# EAGLE design Wilssen_core_v0.214a (EAGLE 6.3)
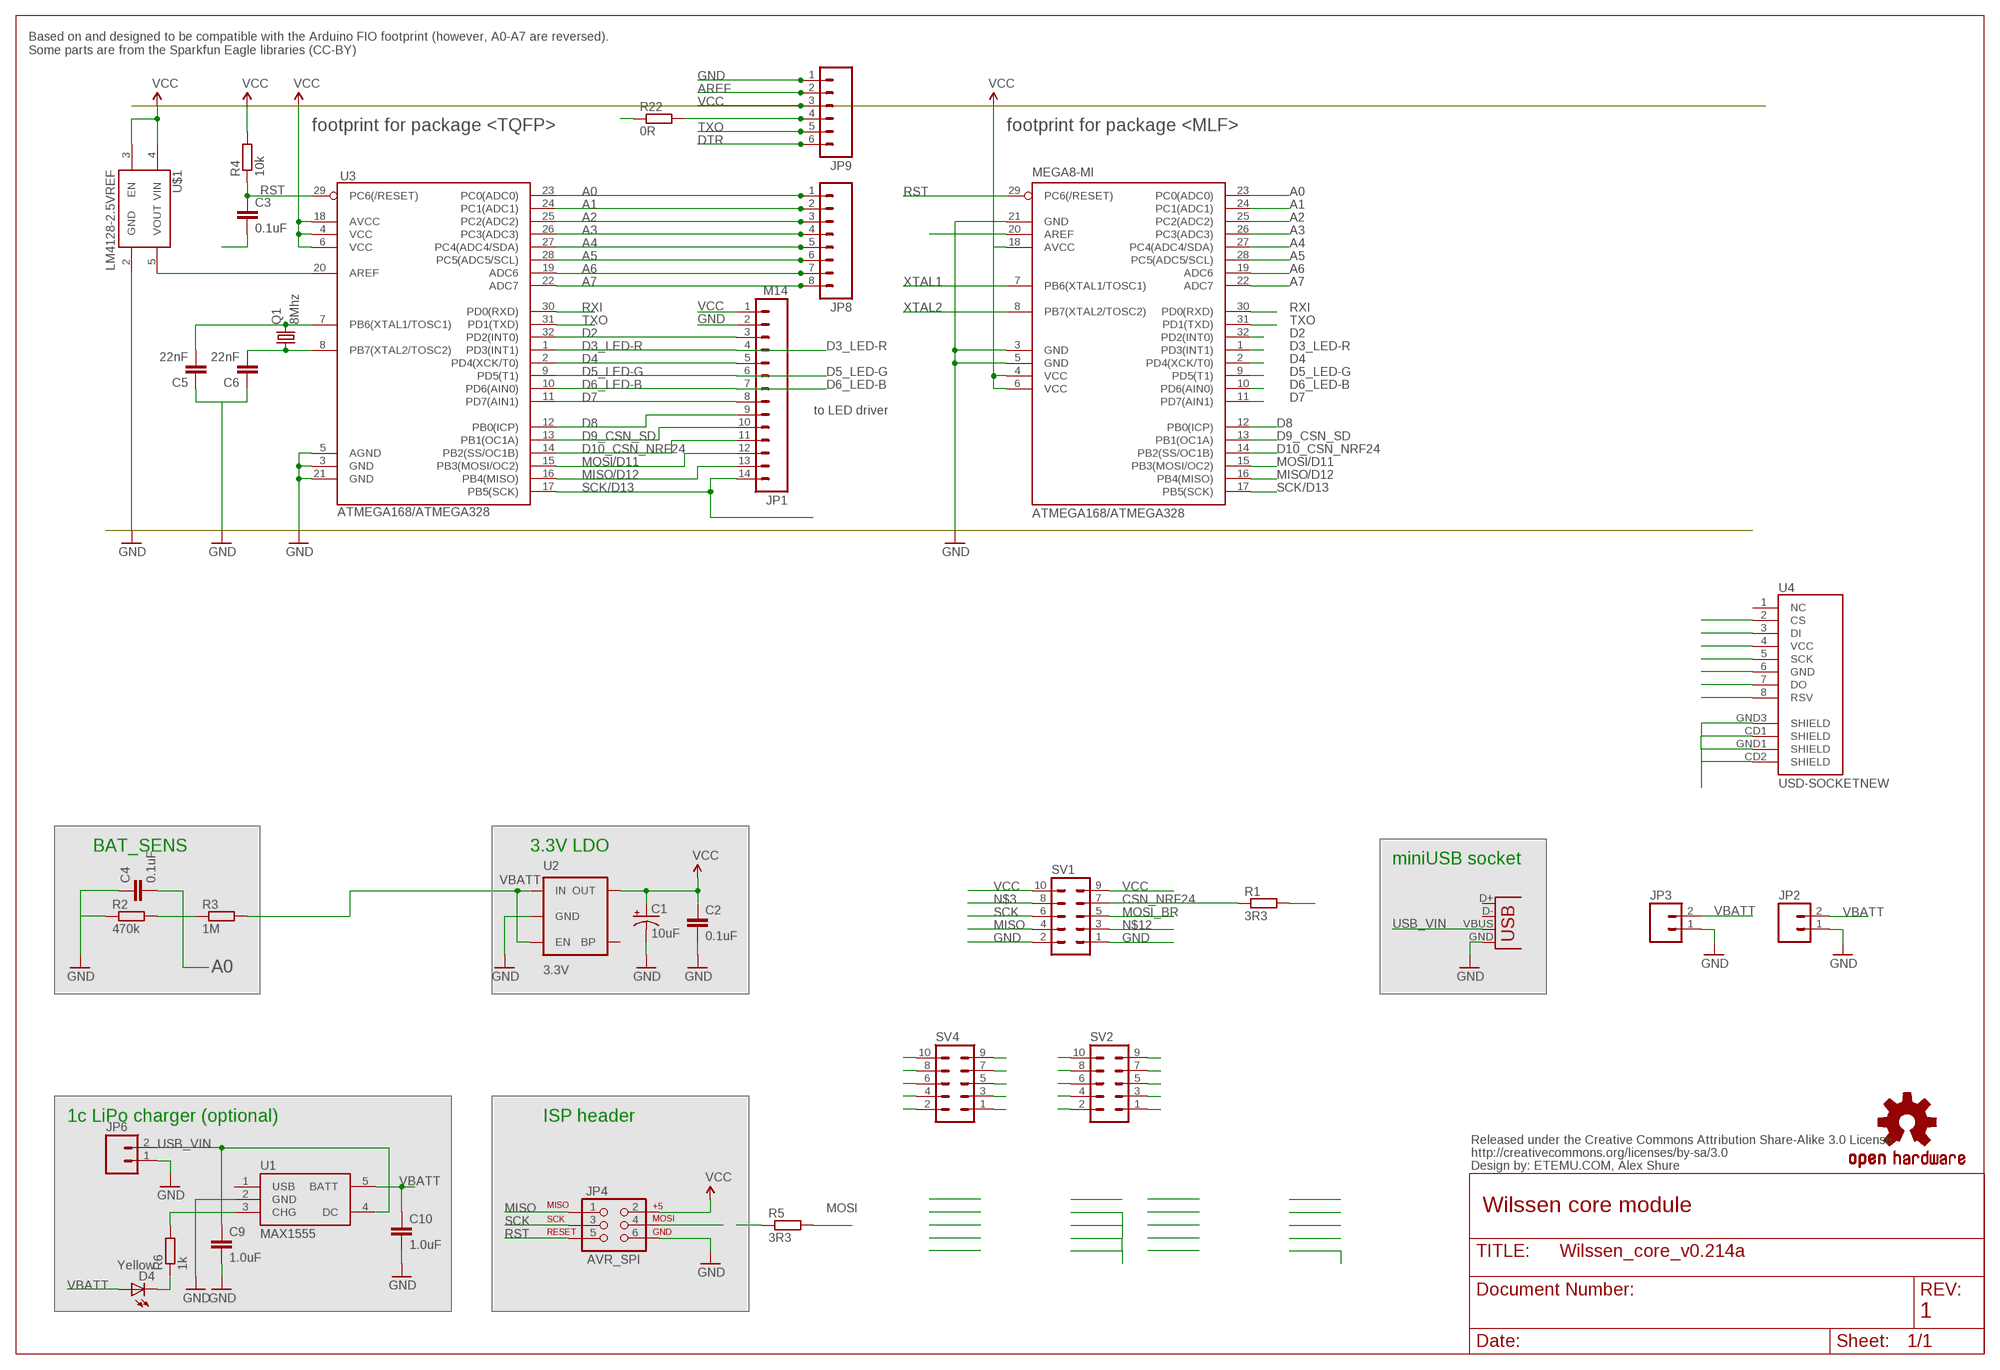
[diagram p0: schematic, sheet 1, part 1 of 2]
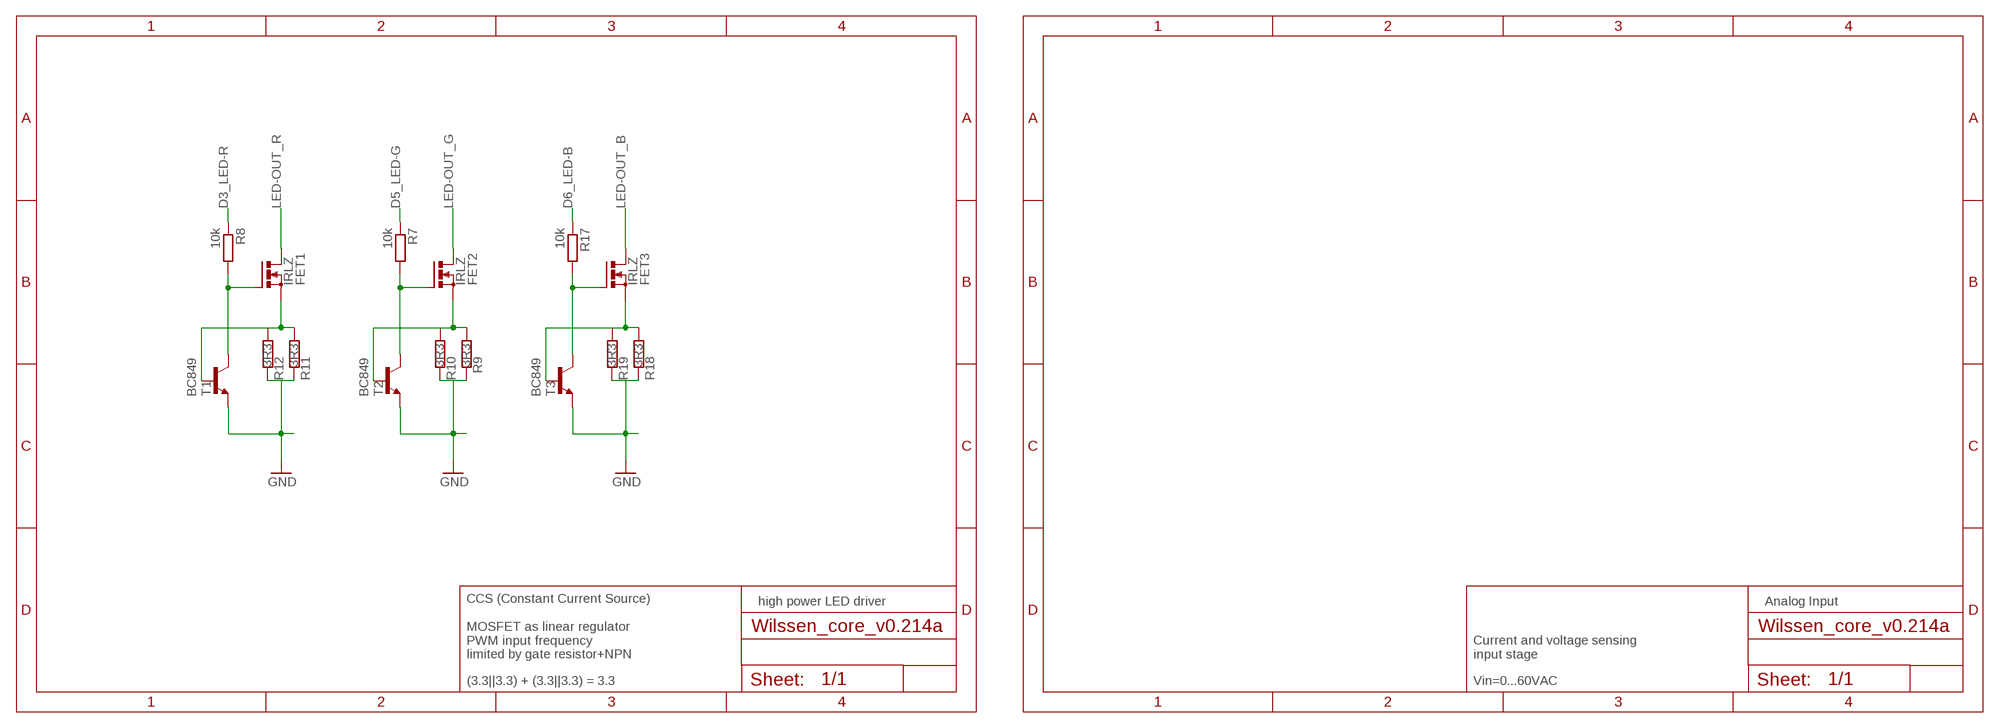
[diagram p1: schematic, sheet 1, part 2 of 2]

## Parts
ATMEGA168/ATMEGA328  MEGA8-MI  [MLF32]
C1  10uF  CAP_POL1206  [EIA3216]
C2  0.1uF  CAP0805  [0805]
C3  0.1uF  CAP0805  [0805]
C4  0.1uF  CAP0805  [0805]
C5  22nF  CAP0805  [0805]
C6  22nF  CAP0805  [0805]
C9  1.0uF  CAP0805  [0805]
C10  1.0uF  CAP0805  [0805]
CC_TEXT1  CREATIVE_COMMONS  [CREATIVE_COMMONS]
D4  Yellow  LED0603  [LED-0603]
FET1  IRLZ  PMOSFET_NTO220BV  [TO220BV]
FET2  IRLZ  PMOSFET_NTO220BV  [TO220BV]
FET3  IRLZ  PMOSFET_NTO220BV  [TO220BV]
JP1  M14  [1X14]
JP2  M02PTH  [1X02]
JP3  M02-JST-2MM-SMT  [S2B-PH]
JP4  AVR_SPI  AVR_SPI_PRG_6PTH  [2X3]
JP6  M02PTH  [1X02]
JP8  M081X08  [1X08]
JP9  M06SIP  [1X06]
LOGO1  OSHW-LOGOS  [OSHW-LOGO-S]
Q1  8Mhz  CRYSTALSM49  [SM49]
R1  3R3  R-EU_R1206  [R1206]
R2  470k  R-EU_R0805  [R0805]
R3  1M  R-EU_R0805  [R0805]
R4  10k  R-EU_R0805  [R0805]
R5  3R3  R-EU_R1206  [R1206]
R6  1k  R-EU_R0805  [R0805]
R7  10k  R-EU_R0805  [R0805]
R8  10k  R-EU_R0805  [R0805]
R9  3R3  R-EU_R1206  [R1206]
R10  3R3  R-EU_R1206  [R1206]
R11  3R3  R-EU_R1206  [R1206]
R12  3R3  R-EU_R1206  [R1206]
R17  10k  R-EU_R0805  [R0805]
R18  3R3  R-EU_R1206  [R1206]
R19  3R3  R-EU_R1206  [R1206]
R22  0R  R-EU_R1206  [R1206]
SV1  MA05-2  [MA05-2]
SV2  MA05-2  [MA05-2]
SV4  MA05-2  [MA05-2]
T1  BC849  [SOT23]
T2  BC849  [SOT23]
T3  BC849  [SOT23]
U1  MAX1555  [SOT23-5]
U2  3.3V  V_REG_LDOSMD  [SOT23-5]
U3  ATMEGA168/ATMEGA328  ATMEGA168  [TQFP32-08]
U4  USD-SOCKETNEW  [MICRO-SD-SOCKET-PP]
U$1  LM4128-2.5VREF  [SOT23-5]
X1  USBSMD  [USB-MINIB]

## Nets
A0: ATMEGA168/ATMEGA328.23(PC0(ADC0)) C4.2 JP8.1 R2.2 R3.1 U3.23(PC0(ADC0))
A1: ATMEGA168/ATMEGA328.24(PC1(ADC1)) JP8.2 U3.24(PC1(ADC1))
A2: ATMEGA168/ATMEGA328.25(PC2(ADC2)) JP8.3 U3.25(PC2(ADC2))
A3: ATMEGA168/ATMEGA328.26(PC3(ADC3)) JP8.4 U3.26(PC3(ADC3))
A4: ATMEGA168/ATMEGA328.27(PC4(ADC4/SDA)) JP8.5 U3.27(PC4(ADC4/SDA))
A5: ATMEGA168/ATMEGA328.28(PC5(ADC5/SCL)) JP8.6 U3.28(PC5(ADC5/SCL))
A6: ATMEGA168/ATMEGA328.19(ADC6) JP8.7 U3.19(ADC6)
A7: ATMEGA168/ATMEGA328.22(ADC7) JP8.8 U3.22(ADC7)
AREF: ATMEGA168/ATMEGA328.20(AREF) JP9.2 U3.20(AREF) U$1.5(VOUT)
CSN: SV2.8 SV4.8
CSN_NRF24: R1.1 SV1.7
D2: ATMEGA168/ATMEGA328.32(PD2(INT0)) JP1.3 U3.32(PD2(INT0))
D3_LED-R: ATMEGA168/ATMEGA328.1(PD3(INT1)) JP1.4 R8.1 U3.1(PD3(INT1))
D4: ATMEGA168/ATMEGA328.2(PD4(XCK/T0)) JP1.5 U3.2(PD4(XCK/T0))
D5_LED-G: ATMEGA168/ATMEGA328.9(PD5(T1)) JP1.6 R7.1 U3.9(PD5(T1))
D6_LED-B: ATMEGA168/ATMEGA328.10(PD6(AIN0)) JP1.7 R17.1 U3.10(PD6(AIN0))
D7: ATMEGA168/ATMEGA328.11(PD7(AIN1)) JP1.8 U3.11(PD7(AIN1))
D8: ATMEGA168/ATMEGA328.12(PB0(ICP)) JP1.9 U3.12(PB0(ICP))
D9_CSN_SD: ATMEGA168/ATMEGA328.13(PB1(OC1A)) JP1.10 U3.13(PB1(OC1A)) U4.2(CS)
D10_CSN_NRF24: ATMEGA168/ATMEGA328.14(PB2(SS/OC1B)) JP1.11 R1.2 U3.14(PB2(SS/OC1B))
DTR: C3.2 JP9.6
GATE1: FET1.G R8.2 T1.3(C)
GATE2: FET2.G R7.2 T2.3(C)
GATE3: FET3.G R17.2 T3.3(C)
GND: ATMEGA168/ATMEGA328.3(GND) ATMEGA168/ATMEGA328.5(GND) ATMEGA168/ATMEGA328.21(GND) C1.C(-) C2.2 C4.1 C5.1 C6.1 C9.2 C10.2 JP1.2 JP2.1 JP3.1 JP4.6 JP6.1 JP9.1 R2.1 R9.2 R10.2 R11.2 R12.2 R18.2 R19.2 SV1.1 SV1.2 SV4.1 SV4.3 SV4.5 SV4.7 T1.2(E) T2.2(E) T3.2(E) U1.2(GND) U2.2(GND) U3.3(GND) U3.5(AGND) U3.21(GND) U4.6(GND) U4.CD1(SHIELD) U4.CD2(SHIELD) U4.GND1(SHIELD) U4.GND3(SHIELD) U$1.2(GND) X1.GND
LED-OUT_B: FET3.D
LED-OUT_G: FET2.D
LED-OUT_R: FET1.D
MISO: ATMEGA168/ATMEGA328.16(PB4(MISO)) JP1.13 JP4.1 SV1.4 SV2.2 SV4.2 U3.16(PB4(MISO))
MOSI: ATMEGA168/ATMEGA328.15(PB3(MOSI/OC2)) JP1.12 JP4.4 R5.2 SV2.10 SV4.10 U3.15(PB3(MOSI/OC2))
MOSI_BR: SV1.5
N$1: R5.1
N$3: SV1.8
N$5: U4.3(DI)
N$8: D4.C R6.1
N$11: R6.2 U1.3(CHG)
N$12: SV1.3
N$15: U4.7(DO)
N$16: U4.8(RSV)
RST: ATMEGA168/ATMEGA328.29(PC6(/RESET)) C3.1 JP4.5 R4.1 SV2.6 SV4.6 U3.29(PC6(/RESET))
RXI: ATMEGA168/ATMEGA328.30(PD0(RXD)) R22.1 U3.30(PD0(RXD))
RXI_CON: JP9.4 R22.2
SCK: ATMEGA168/ATMEGA328.17(PB5(SCK)) JP1.14 JP4.3 SV1.6 SV2.4 SV4.4 U3.17(PB5(SCK)) U4.5(SCK)
SRC1: FET1.S R11.1 R12.1 T1.1(B)
SRC2: FET2.S R9.1 R10.1 T2.1(B)
SRC3: FET3.S R18.1 R19.1 T3.1(B)
TXO: ATMEGA168/ATMEGA328.31(PD1(TXD)) JP9.5 U3.31(PD1(TXD))
USB_VIN: C9.1 JP6.2 U1.4(DC) X1.VBUS
VBATT: C10.1 D4.A JP2.2 JP3.2 R3.2 U1.5(BATT) U2.1(IN) U2.3(EN)
VCC [VCC]: ATMEGA168/ATMEGA328.4(VCC) ATMEGA168/ATMEGA328.6(VCC) ATMEGA168/ATMEGA328.18(AVCC) C1.A(+) C2.1 JP1.1 JP4.2 JP9.3 R4.2 SV1.9 SV1.10 SV4.9 U2.5(OUT) U3.4(VCC) U3.6(VCC) U3.18(AVCC) U4.4(VCC) U$1.3(EN) U$1.4(VIN)
XTAL1: ATMEGA168/ATMEGA328.7(PB6(XTAL1/TOSC1)) C5.2 Q1.2 U3.7(PB6(XTAL1/TOSC1))
XTAL2: ATMEGA168/ATMEGA328.8(PB7(XTAL2/TOSC2)) C6.2 Q1.1 U3.8(PB7(XTAL2/TOSC2))
Unconnected: SV2.1 SV2.3 SV2.5 SV2.7 SV2.9 U1.1(USB) U2.4(BP) U4.1(NC) X1.D+ X1.D-

## Notes on the sheet
- Based on and designed to be compatible with the Arduino FIO footprint (however, A0-A7 are reversed).
  Some parts are from the Sparkfun Eagle libraries (CC-BY)
- footprint for package <TQFP> | footprint for package <MLF>
- to LED driver
- /D11 | /D11
- /D12 | /D12
- /D13 | /D13
- BAT_SENS | 3.3V LDO
- miniUSB socket
- 1c LiPo charger (optional) | ISP header
- ETEMU.COM, Alex Shure
- Wilssen core module
- high power LED driver | Analog Input
- CCS (Constant Current Source)
  
  MOSFET as linear regulator
  PWM input frequency
  limited by gate resistor+NPN
- Current and voltage sensing
  input stage
- 1
- (3.3||3.3) + (3.3||3.3) = 3.3 | Vin=0...60VAC

## Library data of the parts
ATMEGA168/ATMEGA328 = atmel:MEGA8: MICROCONTROLLER 8 Kbytes FLASH, 1 kbytes SRAM, 512 bytes EEPROM, USART, 6-channel 10 bit ADC, 2-channel 8 bit ADC Pin compatible with Atmega48, ATMega88, ATMega168 Source: avr.lbr; MPN: ATMEGA88PA-MU; OC_FARNELL: 1715491; OC_NEWARK: 15R0272
C1 = SparkFun:CAP_POL: Capacitor Polarized These are standard SMD and PTH capacitors. Normally 10uF, 47uF, and 100uF in electrolytic and tantalum varieties. Always verify the external diameter of the through hole cap, it varies with capacity, voltage, and manufacturer. The EIA devices should be standard.
C2-C6 C9 C10 = SparkFun:CAP: Capacitor Standard 0603 ceramic capacitor, and 0.1" leaded capacitor.
CC_TEXT1 = SparkFun-Aesthetics:CREATIVE_COMMONS: Creative Commons License summary
D4 = SparkFun:LED: LEDs Standard schematic elements and footprints for 5mm, 3mm, 1206, and 0603 sized LEDs. 5mm - Spark Fun Electronics SKU : COM-00529 (and others)
FET1-FET3 = transistor-power:PMOSFET_N: Power MOSFET N-Channel
JP1 = SparkFun:M14: Header 14 Standard 14-pin 0.1" header. Use with straight break away headers (SKU : PRT-00116), right angle break away headers (PRT-00553), swiss pins (PRT-00743), machine pins (PRT-00117), and female headers (PRT-00115).
JP2 JP3 JP6 = SparkFun:M02: Header 2 Standard 2-pin 0.1" header. Use with straight break away headers (SKU : PRT-00116), right angle break away headers (PRT-00553), swiss pins (PRT-00743), machine pins (PRT-00117), and female headers (PRT-00115). Molex polarized connector foot print use with SKU : PRT-08233 with associated crimp pins and housings.
JP4 = SparkFun:AVR_SPI_PRG_6: AVR ISP 6 Pin This is the reduced ISP connector for AVR programming. Common on Arduino. This footprint will take up less PCB space and can be used with a 10-pin to 6-pin adapter such as SKU: BOB-08508
JP8 = SparkFun-Connectors:M08: Header 8 Standard 8-pin 0.1" header. Use with straight break away headers (SKU : PRT-00116), right angle break away headers (PRT-00553), swiss pins (PRT-00743), machine pins (PRT-00117), and female headers (PRT-00115).
JP9 = SparkFun-Connectors:M06: Header 6 Standard 6-pin 0.1" header. Use with straight break away headers (SKU : PRT-00116), right angle break away headers (PRT-00553), swiss pins (PRT-00743), machine pins (PRT-00117), and female headers (PRT-00115). Molex polarized connector foot print use with SKU : PRT-08094 with associated crimp pins and housings. NOTES ON THE VARIANTS LOCK and LOCK_LONGPADS... This footprint was designed to help hold the alignment of a through-hole component (i.e. 6-pin header) while soldering it into place. You may notice that each hole has been shifted either up or down by 0.005 of an inch from it's more standard position (which is a perfectly straight line). This slight alteration caused the pins (the squares in the middle) to touch the edges of the holes. Because they are alternating, it causes a "brace" to hold the component in place. 0.005 has proven to be the perfect amount of "off-center" position when using our standard breakaway headers. Although looks a little odd when you look at the bare footprint, once you have a header in there, the alteration is very hard to notice. Also, if you push a header all the way into place, it is covered up entirely on the bottom side. This idea of altering the position of holes to aid alignment will be further integrated into the Sparkfun Library for other footprints. It can help hold any component with 3 or more connection pins.
LOGO1 = SparkFun-Aesthetics:OSHW-LOGO: Open Source Hardware Logo This logo indicates the piece of hardware it is found on incorporates a OSHW license and/or adheres to the definition of open source hardware found here: http://freedomdefined.org/OSHW
Q1 = crystal:CRYSTAL: CRYSTAL; OC_FARNELL: unknown; OC_NEWARK: unknown
R1-R6 R22 = rcl:R-EU_: RESISTOR, European symbol
R7-R12 R17-R19 = resistor:R-EU_: RESISTOR, European symbol
SV1 SV2 SV4 = con-lstb:MA05-2: PIN HEADER; OC_FARNELL: unknown; OC_NEWARK: unknown
T1-T3 = transistor:BC849: NPN TRANSISTOR
U1 = SparkFun:MAX1555: MAX1555 Lithium Charger IC SOT-23 Lithium Polymer charging IC. Schematic element and footprint proven. Spark Fun Electronics SKU : COM-00674
U2 = SparkFun:V_REG_LDO: Voltage Regulator LDO Standard 150mA LDO voltage regulator in SOT-23 layout. Micrel part MIC5205. BP (by-pass) pin is used to lower output noise with 470pF cap.
U3 = SparkFun:ATMEGA168
U4 = SparkFun-Connectors:USD-SOCKET: microSD Socket Push-push type uSD socket. Schematic element and footprint production proven. Spark Fun Electronics SKU : PRT-00127. tDoc lines correctly indicate media card edge positions when inserting (unlocked, locked, depressed).
U$1 = SparkFun-PowerIC:LM4128-2.5VREF: .1% accurate low-current voltage reference
X1 = SparkFun:USB: USB Connectors USB-B-PTH is fully proven SKU : PRT-00139 USB-miniB is fully proven SKU : PRT-00587 USB-A-PCB is untested. USB-A-H is throughly reviewed, but untested. Spark Fun Electronics SKU : PRT-00437 USB-B-SMT is throughly reviewed, but untested. Needs silkscreen touching up. USB-A-S has not been used/tested USB-MB-H has not been used/tested

## Net classes
0 Default: width 0.203 mm
1 VCC: width 0.381 mm
2 LEDPower: width 0.203 mm
3 ButtonSignal: width 0.203 mm

## Board
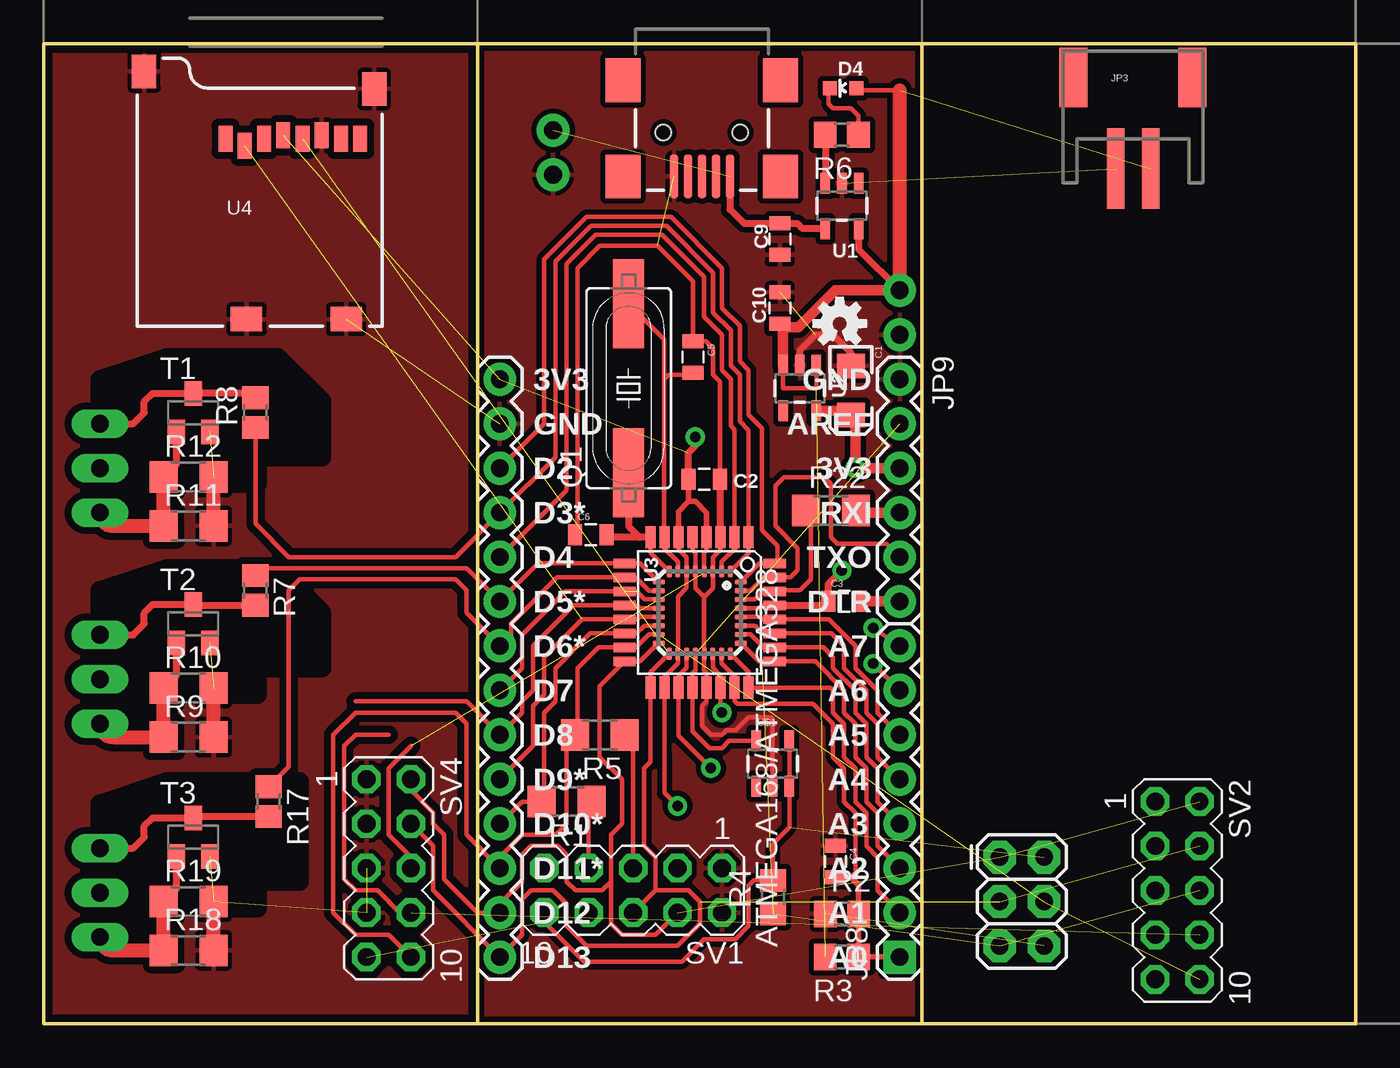
[diagram p2: board, top side]
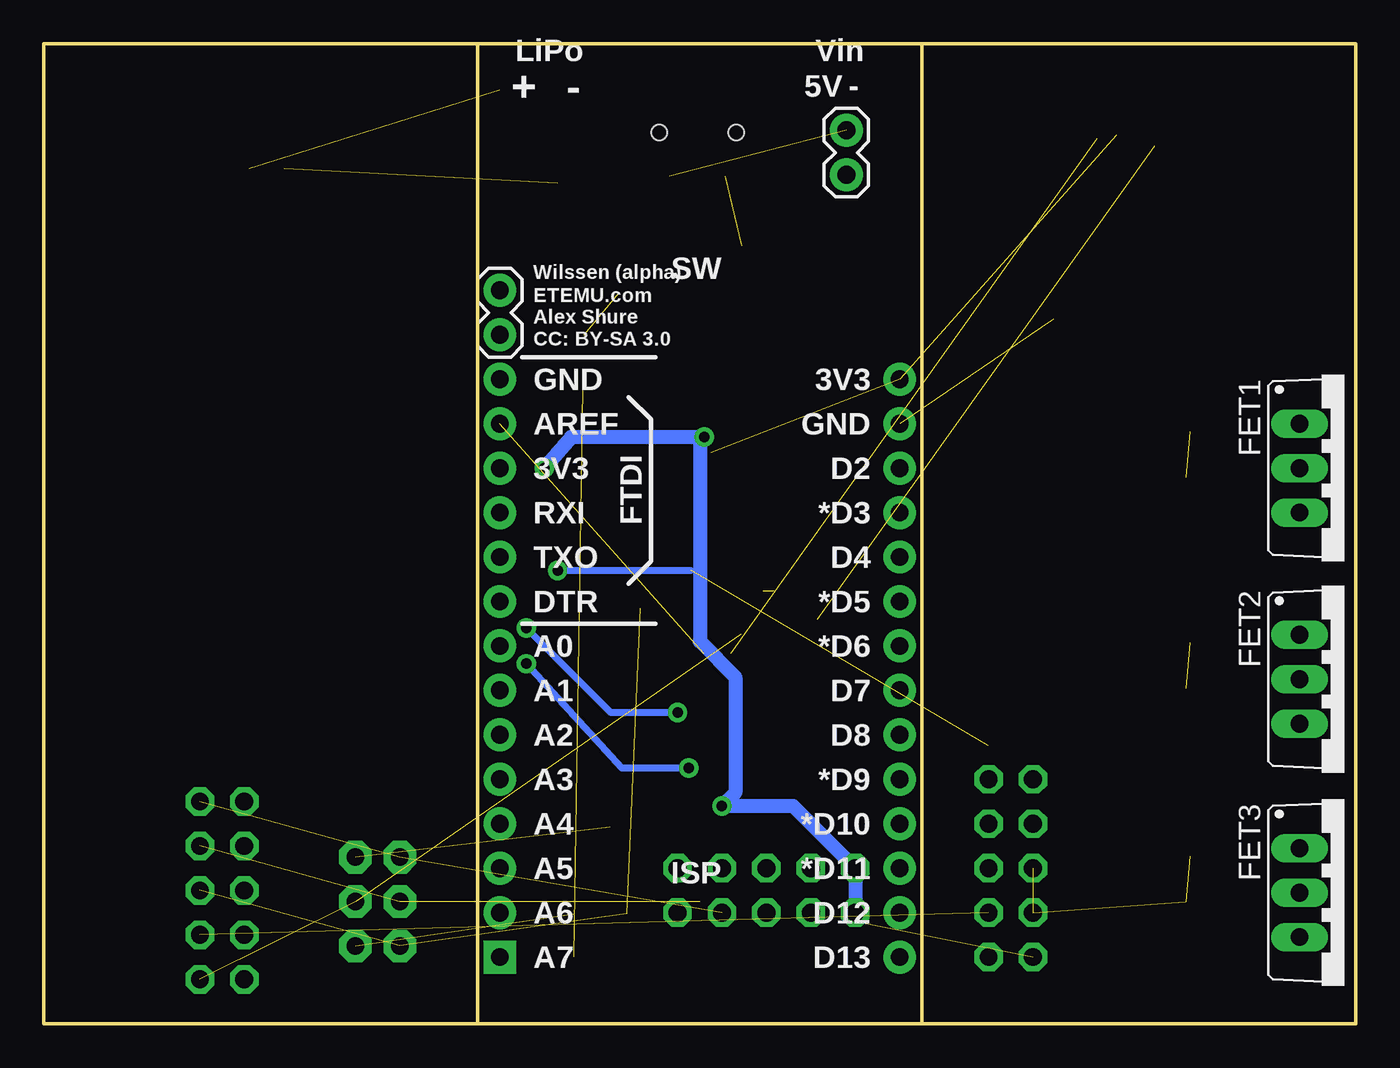
[diagram p3: board, bottom side, seen from below]

Size 75 x 56 mm. Coordinates in mm from the lower left corner, seen from the top.
Outline: 50.2,56 50.2,0
Outline: 50.2,0 24.8,0
Outline: 24.8,0 24.8,56
Outline: 24.8,0 0,0 0,56 24.8,56
Outline: 50.2,0 75,0 75,56 50.2,56
Outline: 24.8,56 50.2,56
Copper layers (1*16): Top 0.035mm / dielectric 1.5mm / Bottom 0.035mm
Design rules "SparkFun *": minimum track width 8mil, minimum drill 20mil, track to track 8mil, track to pad 8mil, pad to pad 8mil, via to via 8mil, smd to smd 8mil, copper to edge 10mil, drill to drill 8mil, minimum pad ring 12mil, minimum via ring 10mil, stop-mask expansion 4mil, vias tented up to drill 25mil, thermal gap 10mil
tRestrict: area 35,21.6 to 40,25.4; area 3.2,30.9 to 15.9,38.1; area 3.2,18.8 to 15.9,26; area 3.2,6.6 to 14.6,13.8; area 30.1,25.7 to 40,45.5

### Footprints (pad centres in the part's own frame; a part is rotated, then mirrored left to right if it is on the bottom)
MLF32 = smd 0.7 x 0.3: 1 -2.35,1.75; 2 -2.35,1.25; 3 -2.35,0.75; 4 -2.35,0.25; 5 -2.35,-0.25; 6 -2.35,-0.75; 7 -2.35,-1.25; 8 -2.35,-1.75; 17 2.35,-1.75; 18 2.35,-1.25; 19 2.35,-0.75; 20 2.35,-0.25; 21 2.35,0.25; 22 2.35,0.75; 23 2.35,1.25; 24 2.35,1.75 | smd 0.3 x 0.7: 9 -1.75,-2.35; 10 -1.25,-2.35; 11 -0.75,-2.35; 12 -0.25,-2.35; 13 0.25,-2.35; 14 0.75,-2.35; 15 1.25,-2.35; 16 1.75,-2.35; 25 1.75,2.35; 26 1.25,2.35; 27 0.75,2.35; 28 0.25,2.35; 29 -0.25,2.35; 30 -0.75,2.35; 31 -1.25,2.35; 32 -1.75,2.35
EIA3216 = smd 1.4 x 1.6: A 1.4,0; C -1.4,0
0805 = smd 0.8 x 1.2: 1 -0.9,0; 2 0.9,0
LED-0603 = smd 0.8 x 0.8: A 0,-0.75; C 0,0.75
TO220BV = drill 1.016 long: D 0,-2.54; G -2.54,-2.54; S 2.54,-2.54
1X14 = drill 1.016 pad 1.88: 1 0,0; 2 2.54,0; 3 5.08,0; 4 7.62,0; 5 10.16,0; 6 12.7,0; 7 15.24,0; 8 17.78,0; 9 20.32,0; 10 22.86,0; 11 25.4,0; 12 27.94,0; 13 30.48,0; 14 33.02,0
1X02 = drill 1.016 pad 1.88: 1 0,0; 2 2.54,0
S2B-PH = smd 1 x 4.6: 1 -1,-3.7; 2 1,-3.7 | smd 1.6 x 3.4: NC1 -3.4,1.5; NC2 3.4,1.5
2X3 = drill 1.016 pad 1.88 octagon: 1 0,0; 2 0,2.54; 3 2.54,0; 4 2.54,2.54; 5 5.08,0; 6 5.08,2.54
1X08 = drill 1.016 pad 1.88 square: 1 0,0 | drill 1.016 pad 1.88: 2 2.54,0; 3 5.08,0; 4 7.62,0; 5 10.16,0; 6 12.7,0; 7 15.24,0; 8 17.78,0
1X06 = drill 1.016 pad 1.88: 1 0,0; 2 2.54,0; 3 5.08,0; 4 7.62,0; 5 10.16,0; 6 12.7,0
SM49 = smd 5.08 x 1.778: 1 -4.826,0; 2 4.826,0
R1206 = smd 1.6 x 1.803: 1 -1.422,0; 2 1.422,0
R0805 = smd 1.3 x 1.5: 1 -0.95,0; 2 0.95,0
R0805' = smd 1.3 x 1.5: 1 -0.85,0; 2 0.85,0
MA05-2 = drill 1.016 octagon: 1 -5.08,-1.27; 2 -5.08,1.27; 3 -2.54,-1.27; 4 -2.54,1.27; 5 0,-1.27; 6 0,1.27; 7 2.54,-1.27; 8 2.54,1.27; 9 5.08,-1.27; 10 5.08,1.27
SOT23 = smd 1 x 1.4: 1 -0.95,-1.1; 2 0.95,-1.1; 3 0,1.1
SOT23-5 = smd 0.55 x 1.2: 1 -0.95,-1.3; 2 0,-1.3; 3 0.95,-1.3; 4 0.95,1.3; 5 -0.95,1.3
TQFP32-08 = smd 1.27 x 0.559: 1 -4.293,2.8; 2 -4.293,2; 3 -4.293,1.2; 4 -4.293,0.4; 5 -4.293,-0.4; 6 -4.293,-1.2; 7 -4.293,-2; 8 -4.293,-2.8; 17 4.293,-2.8; 18 4.293,-2; 19 4.293,-1.2; 20 4.293,-0.4; 21 4.293,0.4; 22 4.293,1.2; 23 4.293,2; 24 4.293,2.8 | smd 0.559 x 1.27: 9 -2.8,-4.293; 10 -2,-4.293; 11 -1.2,-4.293; 12 -0.4,-4.293; 13 0.4,-4.293; 14 1.2,-4.293; 15 2,-4.293; 16 2.8,-4.293; 25 2.8,4.293; 26 2,4.293; 27 1.2,4.293; 28 0.4,4.293; 29 -0.4,4.293; 30 -1.2,4.293; 31 -2,4.293; 32 -2.8,4.293
MICRO-SD-SOCKET-PP = smd 0.8 x 1.5: 1 -8.94,10.7; 2 -7.84,10.3; 3 -6.74,10.7; 4 -5.64,10.9; 5 -4.54,10.7; 6 -3.44,10.9; 7 -2.34,10.7; 8 -1.24,10.7 | smd 1.8 x 1.4: CD1 -2.05,0.4; CD2 -7.75,0.4 | smd 1.4 x 1.9: GND1 -13.6,14.55; GND3 -0.45,13.55
USB-MINIB = smd 2.5 x 0.508: D+ 2.5,0; D- 2.5,0.8; GND 2.5,-1.6; ID 2.5,-0.8; VBUS 2.5,1.6 | smd 2.5 x 2: GND@1 -3,-4.5; GND@2 -3,4.5; GND@3 2.5,4.5; GND@4 2.5,-4.5 | hole 0.9: 0,2.2; 0,-2.2

### Placement (x,y rotation side)
ATMEGA168/ATMEGA328  37.5,23.49 270 top
C1  46.14,36.2 270 top
C2  37.75,31.11 0 top
C3  45.76,24.13 0 top
C4  45.25,9.28 270 top
C5  37.12,38.1 270 top
C6  31.28,27.94 0 top
C9  42.07,44.83 270 top
C10  42.07,40.89 90 top
CC_TEXT1  16.55,-8.25 0 top  (outside the outline)
D4  45.69,53.47 90 top
FET1  0.67,31.75 270 bottom
FET2  0.67,19.68 270 bottom
FET3  0.67,7.49 270 bottom
JP1  26.07,36.83 270 top
JP2  48.93,39.37 90 bottom
JP3  62.26,52.57 0 top
JP4  54.65,9.53 270 top
JP6  29.12,48.51 90 bottom
JP8  48.93,3.81 90 top
JP9  48.93,36.83 270 top
LOGO1  45.5,40.01 0 top
Q1  33.44,36.32 90 top
R1  29.88,12.7 180 top
R2  45.63,6.27 0 top
R3  45.63,3.82 180 top
R4  41.69,7.24 90 top
R5  31.79,16.51 180 top
R6  45.63,50.8 180 top
R7  10k  [R0805']  12.1,24.77 270 top
R8  10k  [R0805']  12.1,34.92 90 top
R9  8.29,16.38 0 top
R10  8.29,19.18 0 top
R11  8.29,28.45 0 top
R12  8.29,31.24 0 top
R17  10k  [R0805']  12.86,12.7 270 top
R18  8.29,4.19 0 top
R19  8.29,6.99 0 top
R22  44.99,29.34 0 top
SV1  33.69,7.62 180 top
SV2  64.81,7.62 270 top
SV4  19.72,8.89 270 top
T1  8.54,34.92 0 top
T2  8.54,22.86 0 top
T3  8.54,10.67 0 top
U1  45.63,46.74 180 top
U2  43.22,36.32 180 top
U3  37.49,23.5 270 top
U4  19.34,39.87 0 top
U$1  41.67,14.86 0 top
X1  37.63,50.92 270 top

### Tracks (layer width: path | path; a pad name or v marks a point on that pad's centre or on a via)
A0
  Top 0.254: ATMEGA168/ATMEGA328.23 38.75,20.59 39.53,19.81 39.49,19.77 U3.23 39.49,18.46 39.66,18.29 43.98,18.29 45.12,17.14 45.12,15.24 45.76,14.61 45.76,12.7 46.39,12.07 46.39,8.64 46.14,8.38
  Top 0.305: JP8.1 R3.1 R2.2 46.59,7.93 46.14,8.38 C4.2
A1
  Top 0.254: ATMEGA168/ATMEGA328.24 40.29,20.11 U3.24 44.96,19.21 45.12,19.05 45.12,17.78 45.76,17.14 45.76,15.24 46.39,14.61 46.39,12.7 47.02,12.07 47.02,10.16 47.66,9.53 47.66,7.62 JP8.2
A2
  Top 0.254: ATMEGA168/ATMEGA328.25 40.89,20.7 U3.25 44.1,20.7 45.76,19.05 45.76,17.78 46.39,17.14 46.39,15.24 47.02,14.61 47.02,12.7 47.66,12.07 47.66,10.16 JP8.3
A3
  Top 0.254: ATMEGA168/ATMEGA328.26 40.4,22.24 41.14,21.5 U3.26 44.57,21.5 45.12,20.95 45.12,20.32 46.39,19.05 46.39,17.78 47.02,17.14 47.02,15.24 47.66,14.61 47.66,12.7 JP8.4
A4
  Top 0.254: ATMEGA168/ATMEGA328.27 40.66,22.74 41.1,22.3 U3.27 45.04,22.3 45.76,21.59 45.76,20.32 47.02,19.05 47.02,17.78 47.66,17.14 47.66,15.24 JP8.5
A5
  Top 0.254: ATMEGA168/ATMEGA328.28 40.92,23.24 41.06,23.11 U3.28 44.88,23.11 46.39,21.59 46.39,20.32 47.66,19.05 47.66,17.78 JP8.6
A6  (via drill 0.6)
  Top 0.254: ATMEGA168/ATMEGA328.19 36.75,20.33 36.29,19.87 U3.19 36.29,16.45 v38.13,14.61 | v47.41,20.57 JP8.7
  Bottom 0.406: v38.13,14.61 41.95,14.61 v47.41,20.57
A7  (via drill 0.6)
  Top 0.254: ATMEGA168/ATMEGA328.22 38.25,20.33 38.69,19.89 U3.22 38.69,17.78 v38.77,17.78 | v47.41,22.61 JP8.8
  Bottom 0.406: v38.77,17.78 42.58,17.78 v47.41,22.61
AREF  (1 unrouted)
  Top 0.254: ATMEGA168/ATMEGA328.20 37.25,20.19 37.09,20.04 U3.20 37.09,16.72 38.06,15.75 38.77,15.75 39.18,16.16 U$1.5
CSN  (1 unrouted)
  Top 0.254: SV4.8 20.36,6.35 19.09,7.62 17.82,7.62 17.18,8.25 17.18,15.88 17.82,16.51 19.72,16.51
CSN_NRF24
  Top 0.254: SV1.7 31.15,12.55 R1.1
D2
  Top 0.254: ATMEGA168/ATMEGA328.32 40.91,26.3 U3.32 41.95,26.47 41.95,27.3 41.06,28.19 41.06,34.04 40.29,34.8 40.29,37.34 39.79,37.85 39.79,39.88 38.77,40.89 38.77,43.18 35.85,46.1 31.02,46.1 28.61,43.69 28.61,34.29 JP1.3
D3_LED-R
  Top 0.254: ATMEGA168/ATMEGA328.1 40.29,26.88 U3.1 40.29,33.91 39.79,34.42 39.79,37.08 39.28,37.59 39.28,39.62 38.26,40.64 38.26,42.93 35.59,45.59 31.28,45.59 29.24,43.56 29.24,32.38 JP1.4 23.53,26.67 14,26.67 12.1,28.57 R8.1
D4
  Top 0.254: ATMEGA168/ATMEGA328.2 38.75,26.4 39.53,27.18 39.49,27.22 U3.2 39.49,33.95 39.28,34.16 39.28,36.83 38.77,37.34 38.77,39.37 37.75,40.39 37.75,42.67 35.34,45.09 31.53,45.09 29.88,43.43 29.88,30.48 JP1.5
D5_LED-G
  Top 0.254: ATMEGA168/ATMEGA328.9 34.09,26.3 U3.9 28.24,26.3 JP1.6 24.16,26.04 12.52,26.04 R7.1
D6_LED-B
  Top 0.254: ATMEGA168/ATMEGA328.10 34.6,24.74 33.84,25.5 U3.10 29.35,25.5 26.7,22.86 26.7,22.22 JP1.7 24.16,23.49 24.16,24.77 23.53,25.4 14.64,25.4 14,24.77 14,14.69 R17.1
D7  (1 unrouted)
  Top 0.254: ATMEGA168/ATMEGA328.11 34.34,24.24 33.88,24.7 | JP1.8 27.34,20.32 27.34,22.22 29.82,24.7 U3.11
D8
  Top 0.254: ATMEGA168/ATMEGA328.12 34.08,23.74 33.94,23.88 33.23,23.88 U3.12 30.29,23.9 27.98,21.59 27.98,19.05 27.34,18.41 27.34,17.78 JP1.9 24.16,18.41 17.82,18.41
D9_CSN_SD  (1 unrouted)
  Top 0.254: ATMEGA168/ATMEGA328.13 34.08,23.24 33.94,23.11 U3.13 30.76,23.11 28.61,20.95 28.61,18.8 27.98,18.16 27.98,15.88 JP1.10
D10_CSN_NRF24
  Top 0.254: ATMEGA168/ATMEGA328.14 34.34,22.74 33.9,22.3 U3.14 31.23,22.3 29.24,20.32 29.24,18.41 28.61,17.78 28.61,12.85 R1.2 | R1.2 27.34,12.7 JP1.11 | R1.2 28.36,12.8
DTR
  Top 0.61: C3.2 JP9.6
GATE1
  Top 0.406: FET1.G 5.12,34.29 5.75,34.92 5.75,35.56 6.21,36.02 T1.3 12.05,36.02 12.1,35.98 R8.2
GATE2
  Top 0.406: FET2.G 5.12,22.22 5.75,22.86 5.75,23.49 6.21,23.96 T2.3 8.59,23.91 R7.2
GATE3
  Top 0.406: FET3.G 5.12,10.03 5.75,10.67 5.75,11.3 6.21,11.77 T3.3 8.63,11.85 R17.2
GND  (10 unrouted)
  Top 0.254: U3.5 37.09,27.08 37.25,26.92 ATMEGA168/ATMEGA328.5 37.25,24.9 37.25,24.89 37.75,24.39 | U3.3 38.69,27.1 38.25,26.66 ATMEGA168/ATMEGA328.3 38.26,25.83 38.26,24.89 37.76,24.39 37.75,24.39 | U3.21 37.75,19.35 | 37.75,24.39 ATMEGA168/ATMEGA328.21 37.75,20.19 37.89,20.06 U3.21 | U3.21 37.89,18.42 37.63,18.16 37.63,17.02 38.13,16.51 38.77,16.51 39.02,16.76 39.53,16.76 40.29,17.53 41.56,17.53 41.67,17.42 U$1.2 | C6.1 30.52,28.08 30.52,43.18 31.79,44.45 35.09,44.45 37.12,42.42 C5.1 37.87,39 38.26,38.61 38.26,37.08 38.65,36.69 C2.2
  Top 0.406: U3.3 38.69,31.08 C2.2 | U2.2 43.22,38.48 44.1,39.37 45.12,39.37 46.14,38.35 C1.C
  Top 0.813: R11.2 R12.2 | R9.2 R10.2 | R18.2 R19.2
  pour Top (isolate 0.305): 24.8,56 50.2,56 50.2,0 24.8,0
  pour Top (isolate 0.406): 0,0 27.34,0 27.34,56 0,56
MISO  (2 unrouted)
  Top 0.254: ATMEGA168/ATMEGA328.16 35.12,21.74 34.08,20.7 U3.16 31.79,19.29 31.79,15.24 33.05,13.97 33.05,11.43 32.42,10.8 32.42,8.13 | SV1.4 34.96,5.08 33.05,5.08 32.42,5.71 32.42,8.13 | SV4.2 20.99,13.34 22.26,12.07 22.26,11.43 22.89,10.8 22.89,8.25 24.8,6.35 JP1.13 26.07,6.86 27.34,8.13 27.34,9.65 27.85,10.16 29.37,10.16 29.88,9.65 29.88,8.13 30.39,7.62 31.91,7.62 32.42,8.13
MOSI  (2 unrouted)
  Top 0.254: ATMEGA168/ATMEGA328.15 34.6,22.24 33.86,21.5 U3.15 31.7,21.5 30.52,20.32 30.52,16.66 R5.2 | R5.2 30.13,16.51 | R5.2 29.88,16.51 29.88,11.43 29.24,10.8 27.34,10.8 26.07,9.53 JP1.12 24.16,10.8 24.16,17.14 23.53,17.78 17.82,17.78 16.55,16.51 16.55,6.35 17.82,5.08 19.72,5.08 SV4.10
MOSI_BR
  Top 0.254: 33.69,16.03 SV1.5
N$1
  Top 0.254: R5.1 33.21,16.36
N$8
  Top 0.254: D4.C 44.87,53.39 44.87,52.58 45.12,52.32 46.14,52.32 46.58,51.88 R6.1
N$11
  Top 0.406: R6.2 U1.3
RST  (via drill 0.6)  (4 unrouted)
  Top 0.254: ATMEGA168/ATMEGA328.29 40.92,23.74 41.09,23.9 U3.29 | SV4.6 20.99,9.53 19.72,10.8 19.72,14.61 20.99,15.88
  Top 0.406: U3.29 44.63,23.9 C3.1 44.85,25.13 v45.63,25.91
  Bottom 0.406: v45.63,25.91 38.01,25.91
RXI
  Top 0.254: ATMEGA168/ATMEGA328.30 40.66,24.24 41.12,24.7 U3.30 41.95,24.77 43.22,24.77 43.85,25.4 43.85,29.06 R22.1
RXI_CON
  Top 0.61: R22.2 46.54,29.21 JP9.4
SCK  (3 unrouted)
  Top 0.254: ATMEGA168/ATMEGA328.17 34.69,20.09 U3.17 34.69,14.97 34.33,14.61 34.33,10.16 34.96,9.53 34.96,7.62 | 34.96,7.62 SV1.6 | 34.96,7.62 36.87,7.62 37.5,6.99 37.5,5.71 36.23,4.45 31.02,4.45 29.88,5.59 29.88,6.86 29.12,7.62 27.85,7.62 27.34,7.11 27.34,5.08 JP1.14 22.26,7.62 22.26,10.16 SV4.4
SRC1
  Top 0.406: R12.1 7.59,31.97 T1.1
  Top 0.813: R12.1 R11.1 3.97,28.45 arc-90 FET1.S
SRC2
  Top 0.406: R10.1 7.59,19.9 T2.1
  Top 0.813: R10.1 R9.1 3.97,16.38 arc-90 FET2.S
SRC3
  Top 0.406: R19.1 7.59,7.71 T3.1
  Top 0.813: R19.1 R18.1 3.97,4.19 arc-90 FET3.S
TXO
  Top 0.254: ATMEGA168/ATMEGA328.31 40.4,24.74 41.16,25.5 U3.31 | 41.95,25.4 U3.31 | U3.31 42.69,25.5 43.09,25.91 43.09,27.18 41.82,28.45 41.82,30.73 42.33,31.24 44.61,31.24 44.99,30.86 44.99,27.81 45.37,27.43 48.17,27.43 JP9.5
USB_VIN  (1 unrouted)
  Top 0.406: X1.VBUS 39.23,46.53 40.03,45.73 C9.1 43.08,45.73 43.34,45.47 44.65,45.47 U1.4
VBATT  (2 unrouted)
  Top 0.254: U2.1 44.16,36.32 42.27,36.32 U2.3 | D4.A 46.57,53.34 48.93,53.34
  Top 0.406: U1.5 46.58,44.26 JP2.2
  Top 0.61: U2.3 42.27,39.8 | JP2.2 45.25,41.91 43.14,39.8 42.27,39.8 | 42.27,39.8 C10.1
  Top 0.813: JP2.2 48.93,53.34
VCC  (via drill 0.6)  (4 unrouted)
  Top 0.254: U3.6 36.29,27.12 36.75,26.66 ATMEGA168/ATMEGA328.6 36.75,24.9 36.25,24.4 ATMEGA168/ATMEGA328.18 36.25,20.59 35.49,19.83 U3.18 35.48,19.2 35.48,15.36 | ATMEGA168/ATMEGA328.4 37.75,26.92 37.89,27.06 U3.4 | 35.48,15.36 35.49,15.36 | SV1.10 28.61,5.84 30.9,3.56 36.48,3.56 37.75,4.83 39.53,4.83 40.29,5.59 40.29,7.87 40.61,8.19 R4.2 41.69,10.29 42.62,11.21 U$1.3 | U$1.4 U$1.3 | U$1.3 42.64,13.54 | 35.48,15.36 35.48,13.2 v36.23,12.45
  Top 0.305: U3.4 37.89,29.21 37.26,29.84 36.87,29.84 | U3.6 36.29,29.27 36.87,29.84 | U3.18 35.48,19.21 | 36.87,29.84 36.87,31.1 C2.1
  Top 0.406: 46.14,34.54 C1.A | C2.1 36.85,32.63 37.25,33.02 v37.25,33.53
  Top 0.61: U2.5 45.91,35.02 C1.A | 46.14,34.54 46.39,34.29 v46.39,31.75 JP9.3
  Bottom 0.813: v37.25,33.53 37.5,33.53 | 37.5,33.53 44.87,33.53 v46.39,31.75 | 37.5,33.53 37.5,21.84 35.47,19.81 35.47,13.21 v36.23,12.45 32.17,12.45 SV1.9 SV1.10
XTAL1
  Top 0.254: ATMEGA168/ATMEGA328.7 36.25,26.4 35.47,27.18 35.49,27.2 U3.7 35.47,27.82 35.47,36.83 | 35.47,36.83 35.47,39.12 Q1.2 | 35.47,36.83 35.72,37.08 36.99,37.08 C5.2
XTAL2
  Top 0.254: ATMEGA168/ATMEGA328.8 34.69,26.9 U3.8 | C6.2 32.43,28.19
  Top 0.406: U3.8 34.07,27.8 | 34.07,27.8 32.32,27.8 C6.2 | Q1.1 33.44,28.43 34.07,27.8

### Text on the board
tPlace: GND | 3V3 | AREF | GND | 3V3 | D2 | RXI | D3* | TXO | D4 | DTR | D5* | D6* | A7 | D7 | A6 | D8 | A5 | D9* | A4 | D10* | A3 | D11* | A2 | D12 | A1 | D13 | A0
bPlace: Vin | LiPo | - | 5V | - | + | SW | Wilssen (alpha) | ETEMU.com / Alex Shure | CC: BY-SA 3.0 | 3V3 | GND | GND | AREF | D2 | FTDI | 3V3 | *D3 | RXI | D4 | TXO | *D5 | DTR | *D6 | A0 | D7 | A1 | D8 | A2 | *D9 | A3 | *D10 | A4 | *D11 | A5 | ISP | D12 | A6 | D13 | A7
tValues: LED DRiVER | WiLSSEN 0.6 | TiVA iNPUT | THE POWER | THE LiGHT | THE MATH | Alex Shure